# Altium schematic sheet sensors.SchDoc: Sensors
size A4; CheckedBy: None; DrawnBy: David, Andrea; DocumentNumber: 4; Revision: V1.0; SheetNumber: 4; SheetTotal: 7; Project: Hefesto; VersionRevision: v1.0; Company: ETSIT; SPICEModelCacheYRUZWUHL: <root> / <DocumentId>YRUZWUHL</DocumentId> / <CacheFrame Number="0"> / <Model Name="cap" Kind="MDL"> / <Text>*Default semiconductor capacitor / .MODEL CAP C()</Text> / </Model> / </CacheFrame> / </root>; TotalSheet: 7; Application_BuildNumber: 4
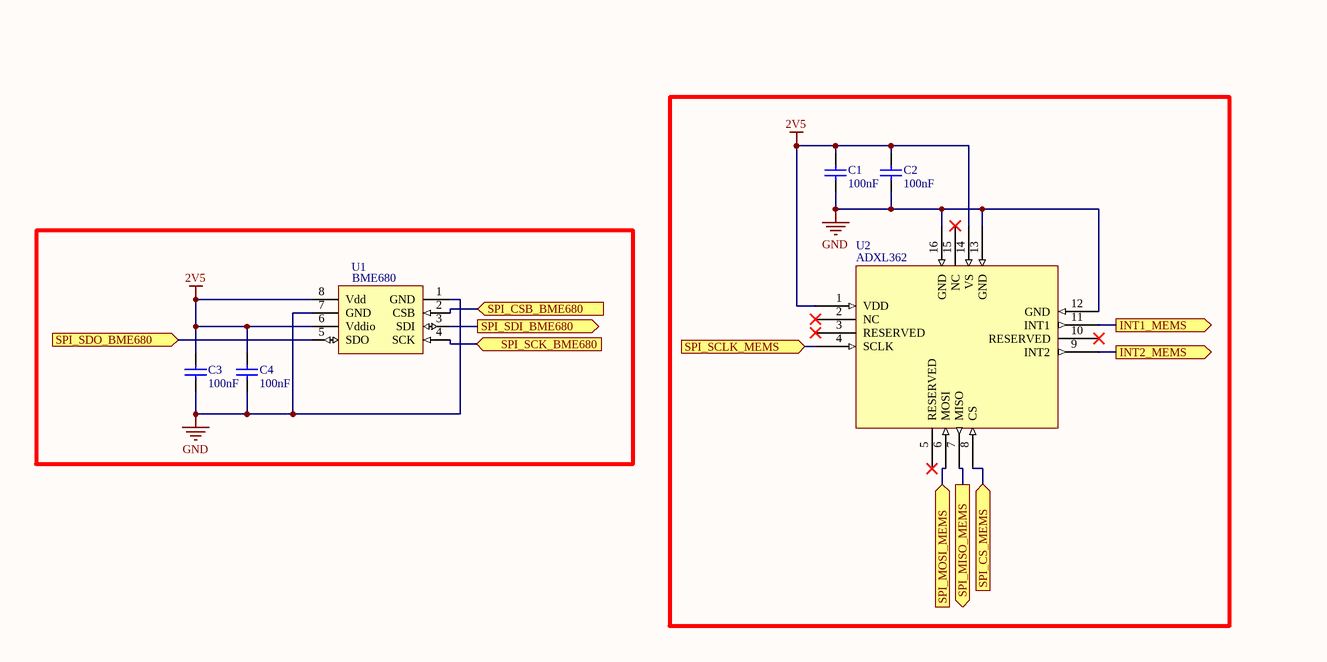
[diagram p0: sensors.SchDoc, left]

## Parts
C1  value 100nF  [1608[0603]]  (hidden comment: Cap Semi)
C2  value 100nF  [1608[0603]]  (hidden comment: Cap Semi)
C3  value 100nF  [1608[0603]]  (hidden comment: Cap Semi)
C4  value 100nF  [1608[0603]]  (hidden comment: Cap Semi)
U1  BME680  [BME680]  (value not drawn)
U2  ADXL362  [ADLX362FP]

## Ports
INT1_MEMS (out, see main[2C]), INT2_MEMS (out, see main[2C]), SPI_CS_MEMS (in, see main[2C]), SPI_CSB_BME680 (in, see main[2B]), SPI_MISO_MEMS (out, see main[2B]), SPI_MOSI_MEMS (in, see main[2C]), SPI_SCK_BME680 (in, see main[2B]), SPI_SCLK_MEMS (in, see main[2B]), SPI_SDI_BME680 (out, see main[2B]), SPI_SDO_BME680 (in, see main[2B])

## Nets
2V5: C1.2 C2.2 C3.2 C4.2 U1.6(Vddio) U1.8(Vdd) U2.1(VDD) U2.14(VS)
GND: C1.1 C2.1 C3.1 C4.1 U1.1(GND) U1.7(GND) U2.12(GND) U2.13(GND) U2.16(GND)
INT1_MEMS: U2.11(INT1) ; port INT1_MEMS
INT2_MEMS: U2.9(INT2) ; port INT2_MEMS
SPI_CS_MEMS: U2.8(CS) ; port SPI_CS_MEMS
SPI_CSB_BME680: U1.2(CSB) ; port SPI_CSB_BME680
SPI_MISO_MEMS: U2.7(MISO) ; port SPI_MISO_MEMS
SPI_MOSI_MEMS: U2.6(MOSI) ; port SPI_MOSI_MEMS
SPI_SCK_BME680: U1.4(SCK) ; port SPI_SCK_BME680
SPI_SCLK_MEMS: U2.4(SCLK) ; port SPI_SCLK_MEMS
SPI_SDI_BME680: U1.3(SDI) ; port SPI_SDI_BME680
SPI_SDO_BME680: U1.5(SDO) ; port SPI_SDO_BME680

Not connected (* = marked no-connect by the designer): U2 2(NC)* 3(RESERVED)* 5(RESERVED)* 10(RESERVED)* 15(NC)*

## Notes on the sheet
- Title:
- Drawn By:
- Page Contents:
- Checked By:
- Size:
- Date:
- File:
- License:
- Email:
- A4
- Number:
- Time:
- Revision:
- Sheet
- Website:
- of

## Library data of the parts
C1-C4 = Cap Semi: Capacitor (Semiconductor SIM Model); Published: 8-Jun-2000; LatestRevisionDate: 29-May-2009; LatestRevisionNote: IPC-7351 Footprint Added.; PackageReference: C1206; Publisher: Altium Limited; PackageDescription: Chip Capacitor